# Altium schematic sheet gd32f205vet6.SchDoc
size 431 x 279 mm; Time: YL10469V21
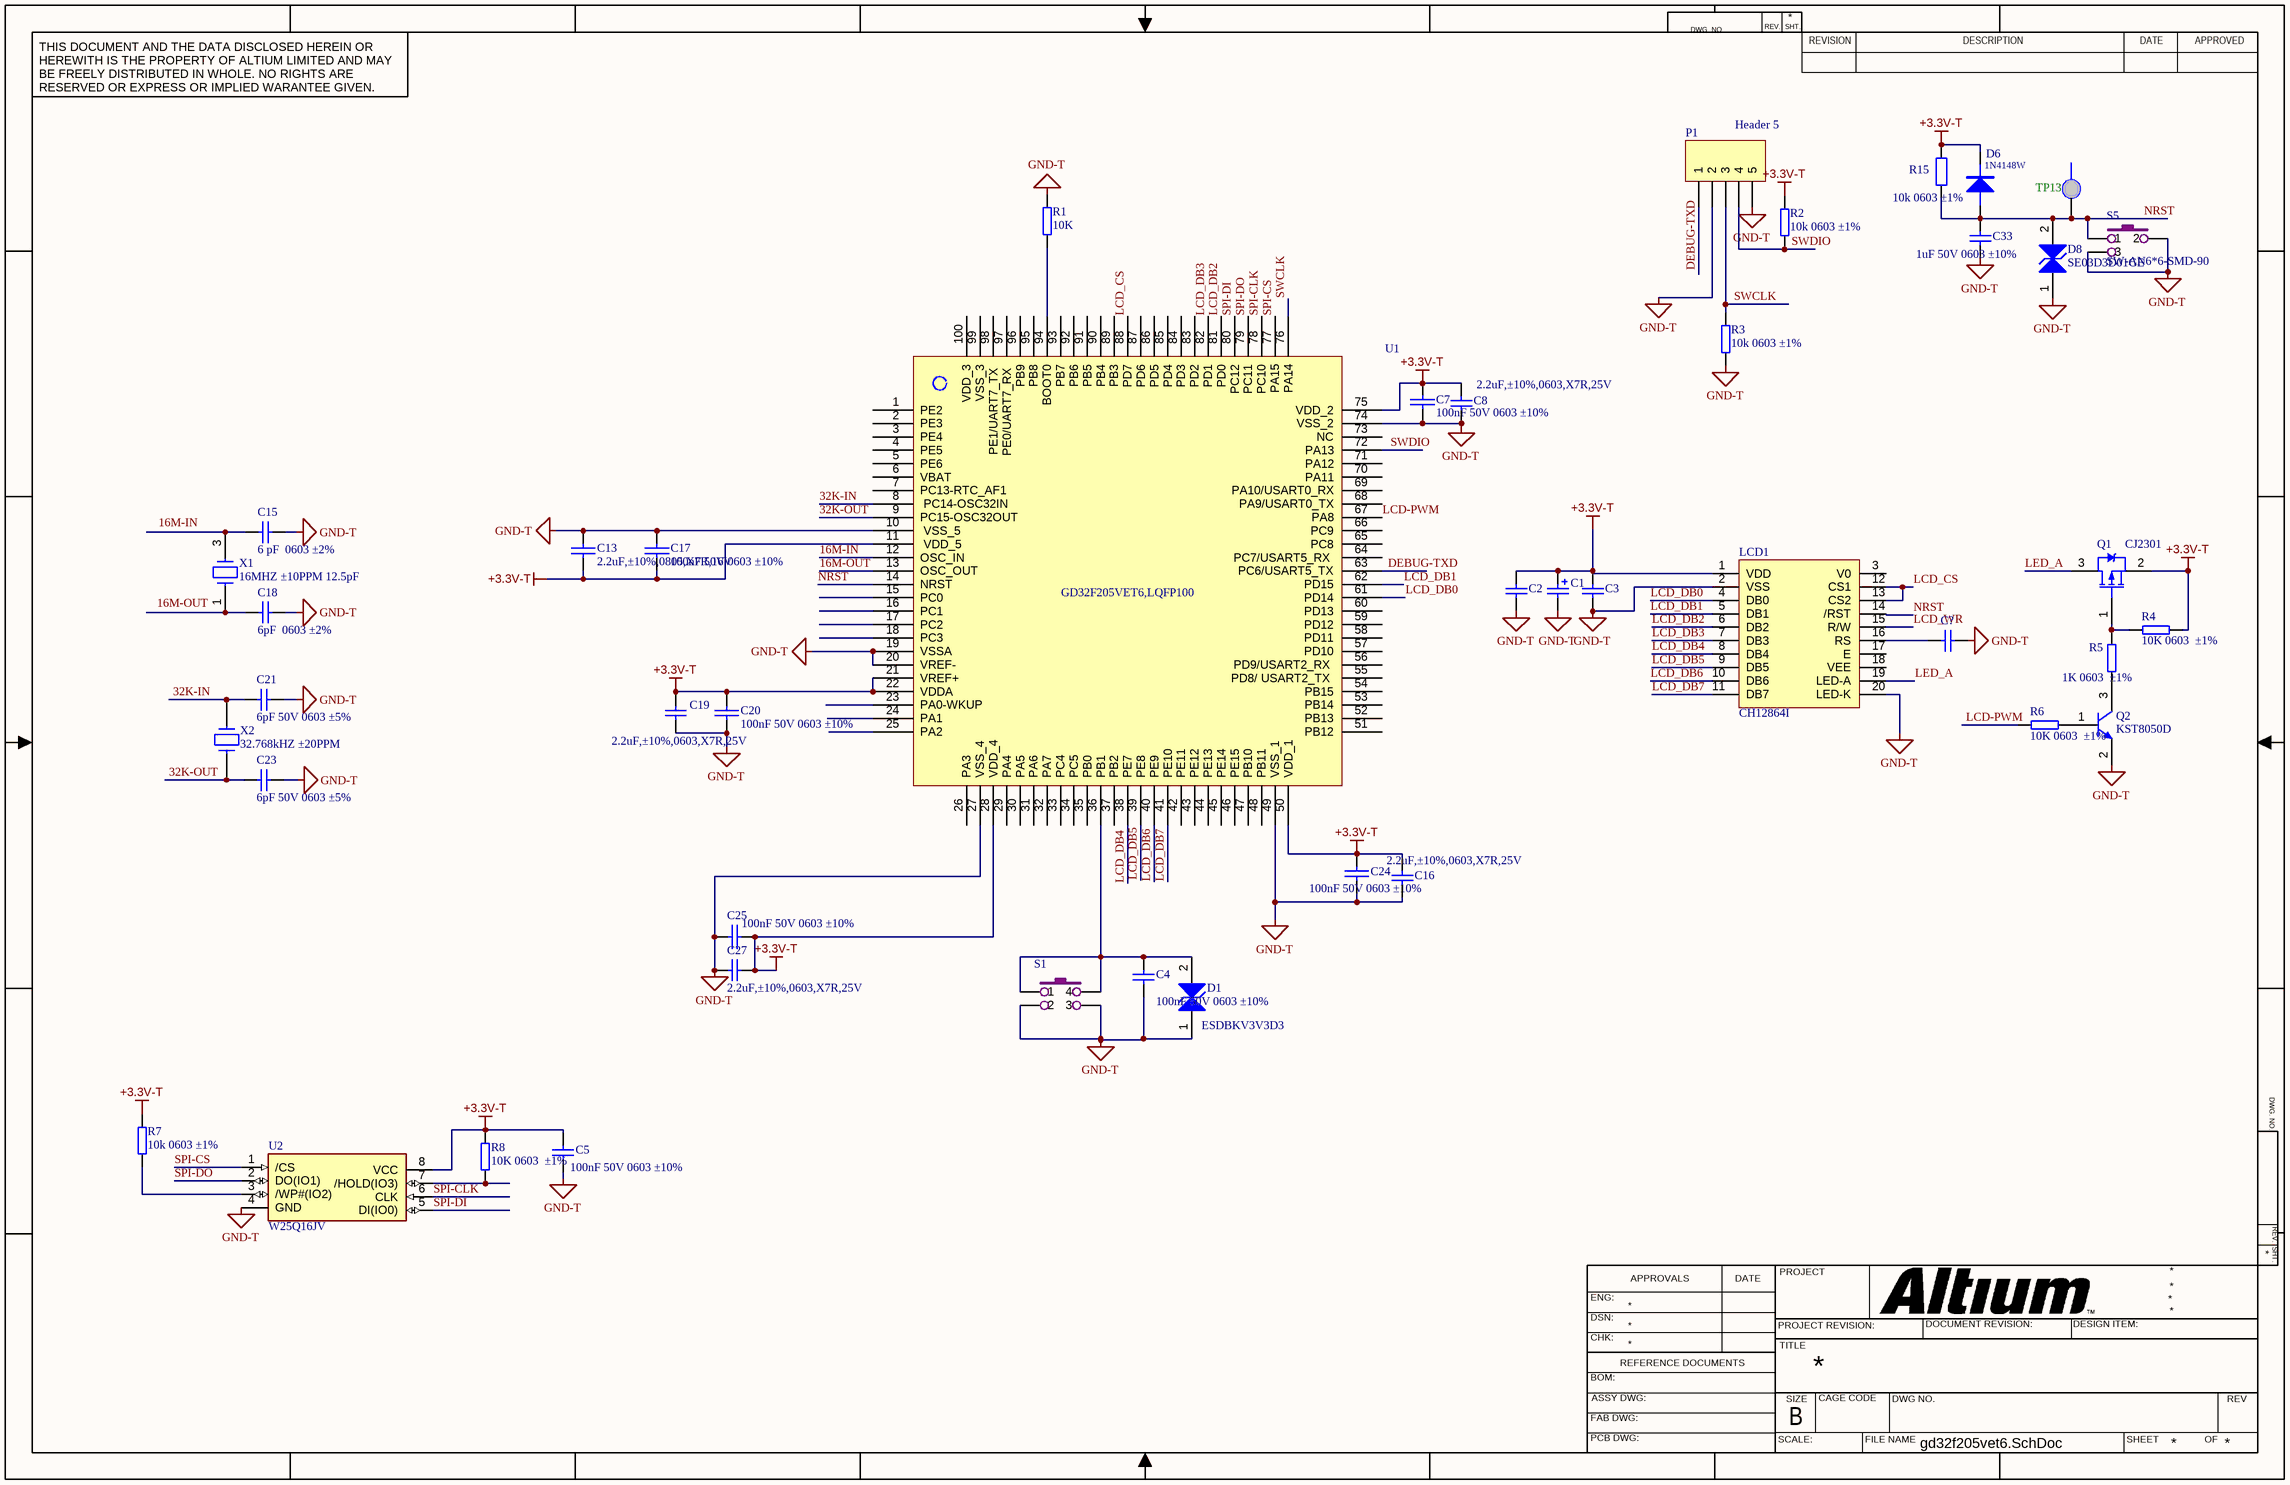
[diagram p0: gd32f205vet6.SchDoc]

## Parts
C1  10V/220uF  [CAP-SMD_BD6.3-L6.6-W6.6-FD]  (value not drawn)
C2  2.2uF,±10%,0603,X7R,25V  [R0603]  (value not drawn)
C3  100nF 50V 0603 ±10%  [R0603]  (value not drawn)
C4  100nF 50V 0603 ±10%  [R0603]
C5  100nF 50V 0603 ±10%  [R0603]
C7  100nF 50V 0603 ±10%  [R0603]
C8  2.2uF,±10%,0603,X7R,25V  [R0603]
C13  2.2uF,±10%,0805,X7R,16V  [R0603]
C15  6 pF  0603 ±2%  [C0603]
C16  2.2uF,±10%,0603,X7R,25V  [R0603]
C17  100nF 50V 0603 ±10%  [R0603]
C18  6pF  0603 ±2%  [C0603]
C19  2.2uF,±10%,0603,X7R,25V  [R0603]
C20  100nF 50V 0603 ±10%  [R0603]
C21  6pF 50V 0603 ±5%  [C0603]
C23  6pF 50V 0603 ±5%  [C0603]
C24  100nF 50V 0603 ±10%  [R0603]
C25  100nF 50V 0603 ±10%  [R0603]
C27  2.2uF,±10%,0603,X7R,25V  [R0603]
C33  1uF 50V 0603 ±10%  [R0603]
C?  2.2uF,±10%,0603,X7R,25V  [R0603]  (value not drawn)
D1  ESDBKV3V3D3  [SOD323]
D6  1N4148W  [SOD-123A]
D8  SE03D3D01GE  [SOD323]
LCD1  CH12864I  [LCD-12864A]
P1  Header 5  [HDR1X5]
Q1  CJ2301  [SOT-23-3]
Q2  KST8050D  [SOT23-3]
R1  10K  [R0603]
R2  10k 0603 ±1%  [R0603]
R3  10k 0603 ±1%  [R0603]
R4  10K 0603  ±1%  [R0603]
R5  1K 0603  ±1%  [R0603]
R6  10K 0603  ±1%  [R0603]
R7  10k 0603 ±1%  [R0603]
R8  10K 0603  ±1%  [R0603]
R15  10k 0603 ±1%  [R0603]
S1  (no value)  [AN6*6-SMD-1]
S5  SW-AN6*6-SMD-90  [SW-SMD_TS-1095F-A5BX-DX-P]
TP13  (no value)  [POINT-2P0]
U1  GD32F205VET6,LQFP100  [LQFP-100_L14.0-W14.0-P0.50-LS16.0-BL]
U2  W25Q16JV  [SOIC-8_5.3-5.3P1.27]
X1  16MHZ ±10PPM 12.5pF  [Y3225]
X2  32.768kHZ ±20PPM  [SMD-7510]

## Nets
+3.3V-T: C1.1 C2.1 C3.1 C5.2 C7.2 C8.1 C13.2 C16.2 C17.1 C19.1 C20.2 C24.2 C25.2 C27.2 D6.2 LCD1.1(VDD) Q1.2(S) R2.2 R4.1 R7.1 R8.1 R15.2 U1.11(VDD_5) U1.21(VREF+) U1.22(VDDA) U1.28(VDD_4) U1.50(VDD_1) U1.75(VDD_2) U2.8(VCC)
GND-T: C1.2 C2.2 C3.2 C4.2 C5.1 C7.1 C8.2 C13.1 C15.2 C16.1 C17.2 C18.2 C19.2 C20.1 C21.2 C23.2 C24.1 C25.1 C27.1 C33.1 C?.2 D1.1 D8.1 LCD1.2(VSS) LCD1.20(LED-K) P1.2 P1.5 Q2.2(E) R1.1 R3.2 S1.2 S1.3 S5.2 S5.3 U1.10(VSS_5) U1.19(VSSA) U1.20(VREF-) U1.27(VSS_4) U1.49(VSS_1) U1.74(VSS_2) U2.4(GND)
16M-IN: U1.12(OSC_IN)
16M-OUT: U1.13(OSC_OUT)
32K-IN: C21.1 U1.8(PC14-OSC32IN) X2.2
32K-OUT: C23.1 U1.9(PC15-OSC32OUT) X2.1
DEBUG-TXD: P1.1 U1.63(PC6/USART5_TX)
LCD-PWM: R6.1 U1.67(PA8)
LCD_CS: LCD1.12(CS1) LCD1.13(CS2) U1.88(PD7)
LCD_DB0: LCD1.4(DB0) U1.61(PD14)
LCD_DB1: LCD1.5(DB1) U1.62(PD15)
LCD_DB2: LCD1.6(DB2) U1.81(PD0)
LCD_DB3: LCD1.7(DB3) U1.82(PD1)
LCD_DB4: LCD1.8(DB4) U1.38(PE7)
LCD_DB5: LCD1.9(DB5) U1.39(PE8)
LCD_DB6: LCD1.10(DB6) U1.40(PE9)
LCD_DB7: LCD1.11(DB7) U1.41(PE10)
LCD_WR: LCD1.15(R/W)
LED_A: LCD1.19(LED-A) Q1.3(D)
NRST: C33.2 D6.1 D8.2 LCD1.14(/RST) R15.1 S5.1 TP13.1 U1.14(NRST)
SPI-CLK: U1.78(PC10) U2.6(CLK)
SPI-CS: U1.77(PA15) U2.1(/CS)
SPI-DI: U1.80(PC12) U2.5(DI(IO0))
SPI-DO: U1.79(PC11) U2.2(DO(IO1))
SWCLK: P1.3 R3.1 U1.76(PA14)
SWDIO: P1.4 R2.1 U1.72(PA13)
NetC4_1: C4.1 D1.2 S1.1 S1.4 U1.36(PB1)
NetC15_1: C15.1 X1.3
NetC18_1: C18.1 X1.1
NetC?_1: C?.1 LCD1.16(RS)
NetQ1_1: Q1.1(G) R4.2 R5.1
NetQ2_1: Q2.1(B) R6.2
NetQ2_3: Q2.3(C) R5.2
NetR1_2: R1.2 U1.94(BOOT0)
NetR7_2: R7.2 U2.3(/WP#(IO2))
NetR8_2: R8.2 U2.7(/HOLD(IO3))

Not connected (* = marked no-connect by the designer): LCD1 3(V0) 17(E) 18(VEE); U1 1(PE2) 2(PE3) 3(PE4) 4(PE5) 5(PE6) 6(VBAT) 7(PC13-RTC_AF1) 15(PC0) 16(PC1) 17(PC2) 18(PC3) 23(PA0-WKUP) 24(PA1) 25(PA2) 26(PA3) 29(PA4) 30(PA5) 31(PA6) 32(PA7) 33(PC4) 34(PC5) 35(PB0) 37(PB2) 42(PE11) 43(PE12) 44(PE13) 45(PE14) 46(PE15) 47(PB10) 48(PB11) 51(PB12) 52(PB13) 53(PB14) 54(PB15) 55(PD8/_USART2_TX_) 56(PD9/USART2_RX_) 57(PD10) 58(PD11) 59(PD12) 60(PD13) 64(PC7/USART5_RX_) 65(PC8) 66(PC9) 68(PA9/USART0_TX) 69(PA10/USART0_RX) 70(PA11) 71(PA12) 73(NC) 83(PD2) 84(PD3) 85(PD4) 86(PD5) 87(PD6) 89(PB3) 90(PB4) 91(PB5) 92(PB6) 93(PB7) 95(PB8) 96(PB9) 97(PE0/UART7_RX_) 98(PE1/UART7_TX_) 99(_VSS_3) 100(_VDD_3)

## Notes on the sheet
- Labels drawn without touching a wire or pin: 16M-IN, 16M-OUT
- DWG. NO.
- REV.
- SHT.
- THIS DOCUMENT AND THE DATA DISCLOSED HEREIN OR HEREWITH IS THE PROPERTY OF ALTIUM LIMITED AND MAY BE FREELY DISTRIBUTED IN WHOLE. NO RIGHTS ARE RESERVED OR EXPRESS OR IMPLIED WARANTEE GIVEN.
- REVISION
- DESCRIPTION
- DATE
- APPROVED
- ENG:
- APPROVALS
- PROJECT
- DSN:
- CHK:
- REFERENCE DOCUMENTS
- PROJECT REVISION:
- TITLE
- DOCUMENT REVISION:
- DESIGN ITEM:
- BOM:
- FAB DWG:
- PCB DWG:
- ASSY DWG:
- SCALE:
- SIZE
- B
- CAGE CODE
- FILE NAME
- DWG NO.
- SHEET
- OF
- REV

## Library data of the parts
C1 = Cap Pol2: Polarized Capacitor (Axial)
C2-C4 C8 C16 C19 C27 C? = Cap: Capacitor; Published: 8-Jun-2000; LatestRevisionDate: 17-Jul-2002; LatestRevisionNote: Re-released for DXP Platform.; PackageReference: RAD-0.3; Publisher: Altium Limited; PackageDescription: Radial Cap, Thru-Hole; 2 Leads; 0.3 in Pin Spacing
C5 = 100nF,X7R,±5%,25V,SMD0603: CAP SMD 0603 100nF 5% 25V X7R; China material number: 142302000178; Value2: ±5%,25V; Value3: C0603; Taiwan material number: *; Taiwan Secondary Source: *; Taiwan Supplier 1: *; Taiwan Supplier Part Number 1: *; China Supplier 1: no record; USA material number: *; Value1: 100nF,X7R
C7 C13 C17 C20 C24 C25 = CAP: Capacitor
C15 C18 C21 C23 = Cap: Capacitor; Number: 30405009; Published: 8-Jun-2000; LatestRevisionDate: 17-Jul-2002; LatestRevisionNote: Re-released for DXP Platform.; PackageReference: RAD-0.3; Publisher: Altium Limited
C33 = Cap: Capacitor; Number: 30405001; Published: 8-Jun-2000; LatestRevisionDate: 17-Jul-2002; LatestRevisionNote: Re-released for DXP Platform.; PackageReference: RAD-0.3; Publisher: Altium Limited
D1 D8 = TVS_1: Value: ESDBKV5V0D3; 物料描述: TVS 管;ESDBKV5V0D3;1路;6V;750W;双向;SOD-323;贴片; 制造商: 江苏长电; 制造商型号: ESDBKV5V0D3，SOD-323; 器件高度: 1mm
D6 = DIODE1: 1N5819; 物料编号: 30409017
LCD1 = CH12864I: 12864 点阵屏; 联系卖家 免费技术支持: 唯一出售店铺网址https://shop463601444.taobao.com; BOM名称: 12864 点阵屏
P1 = Header 5: Header, 5-Pin; LatestRevisionDate: 17-Jul-2002; LatestRevisionNote: Re-released for DXP Platform.; Publisher: Altium Limited
Q1 = PMOS-2: P-Channel Power MOSFET; Note: Pin 4 not drawn and electrically connected to Pin 2.; Published: 8-Jun-2000; LatestRevisionDate: 17-Jul-2002; LatestRevisionNote: Re-released for DXP Platform.; DatasheetVersion: PD-9.390D; PackageVersion: Feb-1997; PackageReference: TO-220AB; Publisher: Altium Limited; PackageDescription: TO, Thru-Hole, Vertical, Heatsink Mounted; 3 In-Line Leads; Pitch 2.54 mm; ComponentLink1Description: Manufacturer Link; ComponentLink1URL: http://www.irf.com/
Q2 = 2N3904: NPN General Purpose Amplifier; Published: 8-Jun-2000; LatestRevisionDate: 15-Jan-2003; LatestRevisionNote: PCB Footprint 'BCY-W3/D4.7' replaced; DatasheetDocument: 1997; PackageReference: TO-92A; Publisher: Altium Limited; Code_JEDEC: TO-92A
R1-R8 = RES2
R15 = Res2: Resistor; Value: 221; Number: 30403017; Published: 8-Jun-2000; LatestRevisionDate: 17-Jul-2002; LatestRevisionNote: Re-released for DXP Platform.; Publisher: Altium Limited
S1 = SW-AN6*6-SMD
TP13 = TEST
U2 = IC_W25Q64FVSSIG: Manufacture: Winbond Electronics Corporation America; AOI Part Number: 142101000713; Descriptions: 64M × 1 FLASH 3V 可编程只读存储器, PDSO8; MPN: W25Q64FVSSIG; Footprint: IC; HelpURL: \\172.30.1.168\rd资料库\PCB Datasheet\ICS\W25Q64FVSSIG.pdf; Temperature: -40degC to +85degC
X1 X2 = CRYSTAL: Number: 30411007